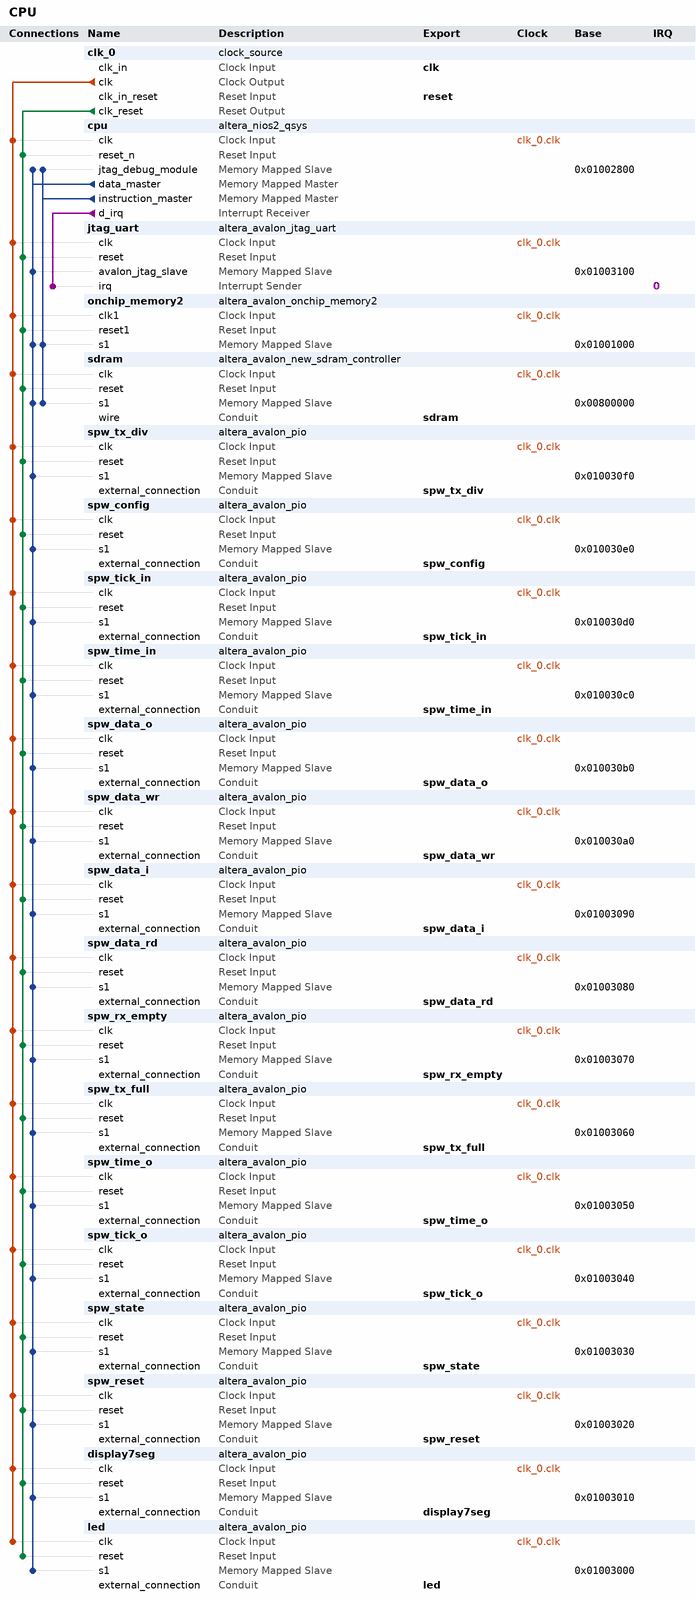
[diagram p0: system contents]
# Platform Designer (Qsys) system CPU, Cyclone III EP3C16F484C6
# Parameters at their usual value, and those the tool derives, are not listed.
package require -exact qsys 13.1
create_system CPU
set_project_property DEVICE_FAMILY {Cyclone III}
set_project_property DEVICE EP3C16F484C6

add_instance clk_0 clock_source 13.1
set_instance_parameter_value clk_0 clockFrequency 50000000

add_instance cpu altera_nios2_qsys 13.1
set_instance_parameter_value cpu resetSlave sdram.s1
set_instance_parameter_value cpu mmu_TLBMissExcSlave None
set_instance_parameter_value cpu exceptionSlave sdram.s1
set_instance_parameter_value cpu breakSlave cpu.jtag_debug_module
set_instance_parameter_value cpu impl Tiny
set_instance_parameter_value cpu icache_size 4096

add_instance jtag_uart altera_avalon_jtag_uart 13.1
set_instance_parameter_value jtag_uart simInteractiveOptions NO_INTERACTIVE_WINDOWS

add_instance onchip_memory2 altera_avalon_onchip_memory2 13.1
set_instance_parameter_value onchip_memory2 dataWidth 32
set_instance_parameter_value onchip_memory2 dualPort false
set_instance_parameter_value onchip_memory2 initMemContent true
set_instance_parameter_value onchip_memory2 initializationFileName onchip_mem.hex
set_instance_parameter_value onchip_memory2 memorySize 4096

add_instance sdram altera_avalon_new_sdram_controller 13.1
set_instance_parameter_value sdram TAC 5.5
set_instance_parameter_value sdram TRCD 20.0
set_instance_parameter_value sdram TRP 20.0
set_instance_parameter_value sdram casLatency 3
set_instance_parameter_value sdram columnWidth 8
set_instance_parameter_value sdram dataWidth 16
set_instance_parameter_value sdram generateSimulationModel false
set_instance_parameter_value sdram model single_Micron_MT48LC4M32B2_7_chip
set_instance_parameter_value sdram numberOfBanks 4
set_instance_parameter_value sdram numberOfChipSelects 1
set_instance_parameter_value sdram powerUpDelay 100.0
set_instance_parameter_value sdram refreshPeriod 15.625
set_instance_parameter_value sdram rowWidth 12

add_instance spw_tx_div altera_avalon_pio 13.1
set_instance_parameter_value spw_tx_div direction Output
set_instance_parameter_value spw_tx_div width 7

add_instance spw_config altera_avalon_pio 13.1
set_instance_parameter_value spw_config direction Output
set_instance_parameter_value spw_config width 3

add_instance spw_tick_in altera_avalon_pio 13.1
set_instance_parameter_value spw_tick_in direction Output
set_instance_parameter_value spw_tick_in width 1

add_instance spw_time_in altera_avalon_pio 13.1
set_instance_parameter_value spw_time_in direction Output
set_instance_parameter_value spw_time_in width 8

add_instance spw_data_o altera_avalon_pio 13.1
set_instance_parameter_value spw_data_o direction Output
set_instance_parameter_value spw_data_o width 9

add_instance spw_data_wr altera_avalon_pio 13.1
set_instance_parameter_value spw_data_wr direction Output
set_instance_parameter_value spw_data_wr width 1

add_instance spw_data_i altera_avalon_pio 13.1
set_instance_parameter_value spw_data_i direction Input
set_instance_parameter_value spw_data_i width 9

add_instance spw_data_rd altera_avalon_pio 13.1
set_instance_parameter_value spw_data_rd direction Output
set_instance_parameter_value spw_data_rd width 1

add_instance spw_rx_empty altera_avalon_pio 13.1
set_instance_parameter_value spw_rx_empty direction Input
set_instance_parameter_value spw_rx_empty width 1

add_instance spw_tx_full altera_avalon_pio 13.1
set_instance_parameter_value spw_tx_full direction Input
set_instance_parameter_value spw_tx_full width 1

add_instance spw_time_o altera_avalon_pio 13.1
set_instance_parameter_value spw_time_o direction Input
set_instance_parameter_value spw_time_o width 8

add_instance spw_tick_o altera_avalon_pio 13.1
set_instance_parameter_value spw_tick_o direction Input
set_instance_parameter_value spw_tick_o width 1

add_instance spw_state altera_avalon_pio 13.1
set_instance_parameter_value spw_state direction Input
set_instance_parameter_value spw_state width 3

add_instance spw_reset altera_avalon_pio 13.1
set_instance_parameter_value spw_reset direction Output
set_instance_parameter_value spw_reset width 1

add_instance display7seg altera_avalon_pio 13.1
set_instance_parameter_value display7seg direction Output
set_instance_parameter_value display7seg width 32

add_instance led altera_avalon_pio 13.1
set_instance_parameter_value led direction Output
set_instance_parameter_value led width 10

# connections
add_connection clk_0.clk cpu.clk clock
add_connection clk_0.clk display7seg.clk clock
add_connection clk_0.clk jtag_uart.clk clock
add_connection clk_0.clk led.clk clock
add_connection clk_0.clk onchip_memory2.clk1 clock
add_connection clk_0.clk sdram.clk clock
add_connection clk_0.clk spw_config.clk clock
add_connection clk_0.clk spw_data_i.clk clock
add_connection clk_0.clk spw_data_o.clk clock
add_connection clk_0.clk spw_data_rd.clk clock
add_connection clk_0.clk spw_data_wr.clk clock
add_connection clk_0.clk spw_reset.clk clock
add_connection clk_0.clk spw_rx_empty.clk clock
add_connection clk_0.clk spw_state.clk clock
add_connection clk_0.clk spw_tick_in.clk clock
add_connection clk_0.clk spw_tick_o.clk clock
add_connection clk_0.clk spw_time_in.clk clock
add_connection clk_0.clk spw_time_o.clk clock
add_connection clk_0.clk spw_tx_div.clk clock
add_connection clk_0.clk spw_tx_full.clk clock
add_connection clk_0.clk_reset cpu.reset_n reset
add_connection clk_0.clk_reset display7seg.reset reset
add_connection clk_0.clk_reset jtag_uart.reset reset
add_connection clk_0.clk_reset led.reset reset
add_connection clk_0.clk_reset onchip_memory2.reset1 reset
add_connection clk_0.clk_reset sdram.reset reset
add_connection clk_0.clk_reset spw_config.reset reset
add_connection clk_0.clk_reset spw_data_i.reset reset
add_connection clk_0.clk_reset spw_data_o.reset reset
add_connection clk_0.clk_reset spw_data_rd.reset reset
add_connection clk_0.clk_reset spw_data_wr.reset reset
add_connection clk_0.clk_reset spw_reset.reset reset
add_connection clk_0.clk_reset spw_rx_empty.reset reset
add_connection clk_0.clk_reset spw_state.reset reset
add_connection clk_0.clk_reset spw_tick_in.reset reset
add_connection clk_0.clk_reset spw_tick_o.reset reset
add_connection clk_0.clk_reset spw_time_in.reset reset
add_connection clk_0.clk_reset spw_time_o.reset reset
add_connection clk_0.clk_reset spw_tx_div.reset reset
add_connection clk_0.clk_reset spw_tx_full.reset reset
add_connection cpu.data_master cpu.jtag_debug_module avalon
set_connection_parameter_value cpu.data_master/cpu.jtag_debug_module baseAddress 0x01002800
add_connection cpu.data_master display7seg.s1 avalon
set_connection_parameter_value cpu.data_master/display7seg.s1 baseAddress 0x01003010
add_connection cpu.data_master jtag_uart.avalon_jtag_slave avalon
set_connection_parameter_value cpu.data_master/jtag_uart.avalon_jtag_slave baseAddress 0x01003100
add_connection cpu.data_master led.s1 avalon
set_connection_parameter_value cpu.data_master/led.s1 baseAddress 0x01003000
add_connection cpu.data_master onchip_memory2.s1 avalon
set_connection_parameter_value cpu.data_master/onchip_memory2.s1 baseAddress 0x01001000
add_connection cpu.data_master sdram.s1 avalon
set_connection_parameter_value cpu.data_master/sdram.s1 baseAddress 0x00800000
add_connection cpu.data_master spw_config.s1 avalon
set_connection_parameter_value cpu.data_master/spw_config.s1 baseAddress 0x010030e0
add_connection cpu.data_master spw_data_i.s1 avalon
set_connection_parameter_value cpu.data_master/spw_data_i.s1 baseAddress 0x01003090
add_connection cpu.data_master spw_data_o.s1 avalon
set_connection_parameter_value cpu.data_master/spw_data_o.s1 baseAddress 0x010030b0
add_connection cpu.data_master spw_data_rd.s1 avalon
set_connection_parameter_value cpu.data_master/spw_data_rd.s1 baseAddress 0x01003080
add_connection cpu.data_master spw_data_wr.s1 avalon
set_connection_parameter_value cpu.data_master/spw_data_wr.s1 baseAddress 0x010030a0
add_connection cpu.data_master spw_reset.s1 avalon
set_connection_parameter_value cpu.data_master/spw_reset.s1 baseAddress 0x01003020
add_connection cpu.data_master spw_rx_empty.s1 avalon
set_connection_parameter_value cpu.data_master/spw_rx_empty.s1 baseAddress 0x01003070
add_connection cpu.data_master spw_state.s1 avalon
set_connection_parameter_value cpu.data_master/spw_state.s1 baseAddress 0x01003030
add_connection cpu.data_master spw_tick_in.s1 avalon
set_connection_parameter_value cpu.data_master/spw_tick_in.s1 baseAddress 0x010030d0
add_connection cpu.data_master spw_tick_o.s1 avalon
set_connection_parameter_value cpu.data_master/spw_tick_o.s1 baseAddress 0x01003040
add_connection cpu.data_master spw_time_in.s1 avalon
set_connection_parameter_value cpu.data_master/spw_time_in.s1 baseAddress 0x010030c0
add_connection cpu.data_master spw_time_o.s1 avalon
set_connection_parameter_value cpu.data_master/spw_time_o.s1 baseAddress 0x01003050
add_connection cpu.data_master spw_tx_div.s1 avalon
set_connection_parameter_value cpu.data_master/spw_tx_div.s1 baseAddress 0x010030f0
add_connection cpu.data_master spw_tx_full.s1 avalon
set_connection_parameter_value cpu.data_master/spw_tx_full.s1 baseAddress 0x01003060
add_connection cpu.instruction_master cpu.jtag_debug_module avalon
set_connection_parameter_value cpu.instruction_master/cpu.jtag_debug_module baseAddress 0x01002800
add_connection cpu.instruction_master onchip_memory2.s1 avalon
set_connection_parameter_value cpu.instruction_master/onchip_memory2.s1 baseAddress 0x01001000
add_connection cpu.instruction_master sdram.s1 avalon
set_connection_parameter_value cpu.instruction_master/sdram.s1 baseAddress 0x00800000
add_connection cpu.d_irq jtag_uart.irq interrupt
set_connection_parameter_value cpu.d_irq/jtag_uart.irq irqNumber 0

# exported interfaces
add_interface clk clock sink
set_interface_property clk EXPORT_OF clk_0.clk_in
add_interface reset reset sink
set_interface_property reset EXPORT_OF clk_0.clk_in_reset
add_interface sdram conduit end
set_interface_property sdram EXPORT_OF sdram.wire
add_interface spw_tx_div conduit end
set_interface_property spw_tx_div EXPORT_OF spw_tx_div.external_connection
add_interface spw_config conduit end
set_interface_property spw_config EXPORT_OF spw_config.external_connection
add_interface spw_tick_in conduit end
set_interface_property spw_tick_in EXPORT_OF spw_tick_in.external_connection
add_interface spw_time_in conduit end
set_interface_property spw_time_in EXPORT_OF spw_time_in.external_connection
add_interface spw_reset conduit end
set_interface_property spw_reset EXPORT_OF spw_reset.external_connection
add_interface spw_state conduit end
set_interface_property spw_state EXPORT_OF spw_state.external_connection
add_interface spw_tick_o conduit end
set_interface_property spw_tick_o EXPORT_OF spw_tick_o.external_connection
add_interface spw_time_o conduit end
set_interface_property spw_time_o EXPORT_OF spw_time_o.external_connection
add_interface spw_data_i conduit end
set_interface_property spw_data_i EXPORT_OF spw_data_i.external_connection
add_interface spw_tx_full conduit end
set_interface_property spw_tx_full EXPORT_OF spw_tx_full.external_connection
add_interface spw_rx_empty conduit end
set_interface_property spw_rx_empty EXPORT_OF spw_rx_empty.external_connection
add_interface spw_data_rd conduit end
set_interface_property spw_data_rd EXPORT_OF spw_data_rd.external_connection
add_interface spw_data_wr conduit end
set_interface_property spw_data_wr EXPORT_OF spw_data_wr.external_connection
add_interface spw_data_o conduit end
set_interface_property spw_data_o EXPORT_OF spw_data_o.external_connection
add_interface display7seg conduit end
set_interface_property display7seg EXPORT_OF display7seg.external_connection
add_interface led conduit end
set_interface_property led EXPORT_OF led.external_connection

set_interconnect_requirement {$system} qsys_mm.clockCrossingAdapter HANDSHAKE
set_interconnect_requirement {$system} qsys_mm.maxAdditionalLatency 1
set_interconnect_requirement {$system} qsys_mm.insertDefaultSlave false

save_system CPU.qsys
